# EAGLE design ECG_v2.2 (EAGLE 9.5.2)
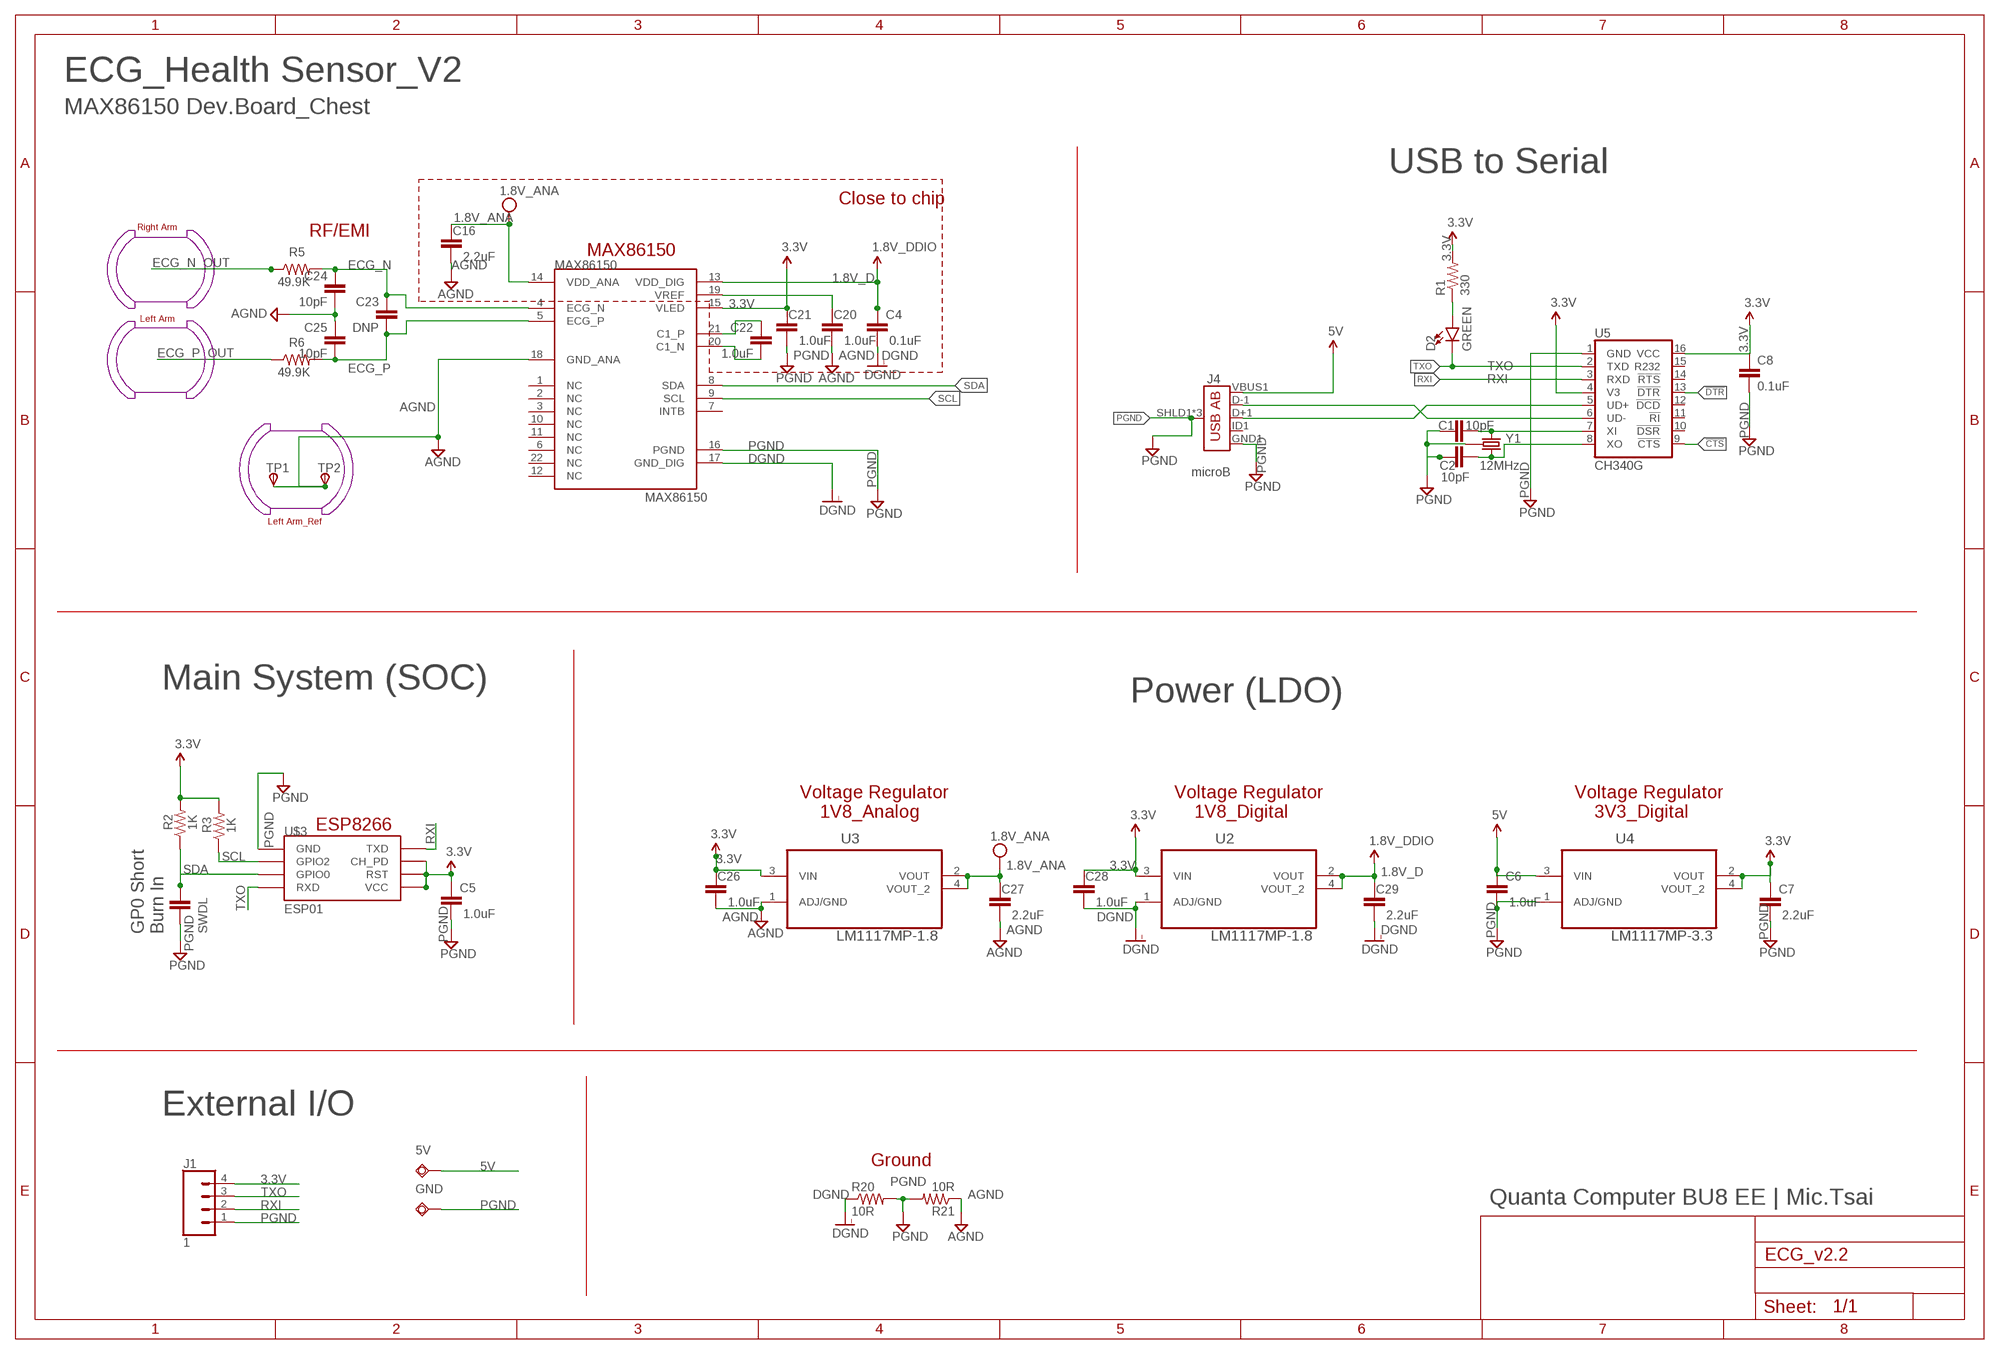
[diagram p0: schematic, sheet 1]

## Parts
5V  TPSQTP20R  [TP20R]
C1  10pF  10PF-50V-5%(0603)  [0603-CAP]
C2  10pF  10PF-50V-5%(0603)  [0603-CAP]
C4  0.1uF  1.0UF-0805-25V-10%  [0805]
C5  1.0uF  1.0UF-0805-25V-10%  [0805]
C6  1.0uF  1.0UF-0805-25V-10%  [0805]
C7  2.2uF  1.0UF-0805-25V-10%  [0805]
C8  0.1uF  0.1UF-25V(+80/-20%)(0603)  [0603-CAP]
C16  2.2uF  1.0UF-0805-25V-10%  [0805]
C20  1.0uF  1.0UF-0805-25V-10%  [0805]
C21  1.0uF  1.0UF-0805-25V-10%  [0805]
C22  1.0uF  1.0UF-0805-25V-10%  [0805]
C23  DNP  1.0UF-0402-16V-10%  [0402]
C24  10pF  1.0UF-0402-16V-10%  [0402]
C25  10pF  1.0UF-0402-16V-10%  [0402]
C26  1.0uF  1.0UF-0805-25V-10%  [0805]
C27  2.2uF  1.0UF-0805-25V-10%  [0805]
C28  1.0uF  1.0UF-0805-25V-10%  [0805]
C29  2.2uF  1.0UF-0805-25V-10%  [0805]
D2  GREEN  LED-GREEN0603  [LED-0603]
GND  TPSQTP20R  [TP20R]
J1  1  CONN_04  [1X04]
J4  microB  USB_AB_SMT  [USB-AB-MICRO-SMD]
MAX86150  MAX86150  [MAX86150]
R1  330  330OHM1/10W1%(0603)  [0603-RES]
R2  1K  RESISTOR0805-RES  [0805]
R3  1K  RESISTOR0805-RES  [0805]
R5  49.9K  RESISTOR0805-RES  [0805]
R6  49.9K  RESISTOR0805-RES  [0805]
R20  10R  RESISTOR0805-RES  [0805]
R21  10R  RESISTOR0805-RES  [0805]
SWDL  10pF  1.0UF-0402-16V-10%  [0402]
TP1  TPSB1,27  [B1,27]
TP2  TPSB1,27  [B1,27]
U2  LM1117MP-1.8  [SOT230P696X180-4N]
U3  LM1117MP-1.8  [SOT230P696X180-4N]
U4  LM1117MP-3.3  [SOT230P696X180-4N]
U5  CH340G  CH340GSMD  [SO016]
U$3  ESP01  [ESP01]
Y1  12MHz  CRYSTAL-GROUNDED3.2X2.5  [CRYSTAL-SMD-3.2X2.5]

## Nets
1.8V_ANA: C16.1 C27.1 MAX86150.14(VDD_ANA) U3.2(VOUT) U3.4(VOUT_2)
1.8V_D: C4.1 C29.1 MAX86150.13(VDD_DIG) U2.2(VOUT) U2.4(VOUT_2) ; supply symbol labelled 1.8V_DDIO
3.3V: C5.1 C7.1 C8.1 C21.1 C26.1 C28.1 J1.4 MAX86150.15(VLED) R1.2 R2.2 R3.2 U2.3(VIN) U3.3(VIN) U4.2(VOUT) U4.4(VOUT_2) U5.4(V3) U5.16(VCC) U$3.CH_PD U$3.RST U$3.VCC
5V: 5V.TP C6.1 J4.VBUS1(VBUS) U4.3(VIN)
!CTS: U5.9(!CTS)
!DTR: U5.13(!DTR)
AGND: C16.2 C20.2 C24.2 C25.1 C26.2 C27.2 MAX86150.18(GND_ANA) R21.1 TP1.PP TP2.PP U3.1(ADJ/GND)
DGND: C4.2 C28.2 C29.2 MAX86150.17(GND_DIG) R20.1 U2.1(ADJ/GND)
ECG_N: C23.1 C24.1 MAX86150.4(ECG_N) R5.2
ECG_N_OUT: R5.1
ECG_P: C23.2 C25.2 MAX86150.5(ECG_P) R6.2
ECG_P_OUT: R6.1
N$2: D2.A R1.1
N$7: C22.1 MAX86150.21(C1_P)
N$8: C22.2 MAX86150.20(C1_N)
N$10: C20.1 MAX86150.19(VREF)
N$12: C2.2 U5.8(XO) Y1.3
N$13: C1.2 U5.7(XI) Y1.1
N$14: J4.D-1(D-) U5.6(UD-)
N$15: J4.D+1(D+) U5.5(UD+)
PGND: C1.1 C2.1 C5.2 C6.2 C7.2 C8.2 C21.2 GND.TP J1.1 J4.GND1(GND) J4.SHLD1(SHIELD) J4.SHLD2(SHIELD) J4.SHLD3(SHIELD) MAX86150.16(PGND) R20.2 R21.2 SWDL.2 U4.1(ADJ/GND) U5.1(GND) U$3.GND Y1.2(GND) Y1.4(GND)
RXI: J1.2 U5.3(RXD) U$3.TX(TXD)
SCL: MAX86150.9(SCL) R3.1 U$3.GPIO2
SDA: MAX86150.8(SDA) R2.1 SWDL.1 U$3.GPIO0
TXO: D2.C J1.3 U5.2(TXD) U$3.RX(RXD)
Unconnected: J4.ID1(USBID) MAX86150.1(NC) MAX86150.2(NC) MAX86150.3(NC) MAX86150.6(NC) MAX86150.7(INTB) MAX86150.10(NC) MAX86150.11(NC) MAX86150.12(NC) MAX86150.22(NC) U5.10(!DSR) U5.11(!RI) U5.12(!DCD) U5.14(!RTS) U5.15(R232)

## Notes on the sheet
- ECG_Health Sensor_V2
- MAX86150 Dev.Board_Chest
- USB to Serial
- Close to chip
- Right Arm
- RF/EMI
- MAX86150
- Left Arm
- Left Arm_Ref
- Main System (SOC)
- Power (LDO)
- Voltage Regulator
      1V8_Analog
- Voltage Regulator
      1V8_Digital
- Voltage Regulator
      3V3_Digital
- ESP8266
- GP0 Short
  Burn In
- External I/O
- Ground
- Quanta Computer BU8 EE | Mic.Tsai

## Library data of the parts
5V GND = testpad:TPSQ: Test pad
C1 C2 = SparkFun-Capacitors:10PF-50V-5%(0603): CAP-11812; PROD_ID: CAP-11812
C4 C7 C16 C27 C29 = SparkFun-Capacitors:1.0UF: 1µF ceramic capacitors A capacitor is a passive two-terminal electrical component used to store electrical energy temporarily in an electric field.; PROD_ID: CAP-08064; VALUE: 1.0uF
C5 C6 C20-C22 C26 C28 = SparkFun-Capacitors:1.0UF: 1µF ceramic capacitors A capacitor is a passive two-terminal electrical component used to store electrical energy temporarily in an electric field.; PROD_ID: CAP-08064
C8 = SparkFun-Capacitors:0.1UF-25V(+80/-20%)(0603): CAP-00810 Ceramic Standard decoupling cap; PROD_ID: CAP-00810
C23-C25 SWDL = SparkFun-Capacitors:1.0UF: 1µF ceramic capacitors A capacitor is a passive two-terminal electrical component used to store electrical energy temporarily in an electric field.; PROD_ID: CAP-12417; VALUE: 1.0uF
D2 = SparkFun-LED:LED-GREEN: Green SMD LED Used in manufacturing of various products at SparkFun Packages: 0603 - SMD 0603 package [Product Link] <http://www.futureelectronics.com/en/technologies/semiconductors/optoelectronics/leds/Pages/9894312-LTST-C190GKT.aspx?CrossPart=HSMG-C190&IM=0> LilyPad 1206 - SMD1206 LilyPad package [Product Link] <http://www.futureelectronics.com/en/Technologies/Product.aspx?ProductID=IN150NGHARVATEKCORPORATION2049943&IM=0> 1206 - SMD1206 package [Product Link] <http://www.futureelectronics.com/en/technologies/semiconductors/optoelectronics/leds/Pages/8315665-LTST-C150KGKT.aspx?IM=0> 1206 Bottom Mount -SMD 1206 Bottom Mount [Product Link] <http://www.digikey.com/product-detail/en/lite-on-inc/LTST-C230KGKT/160-1456-1-ND/386854> SparkFun Products: Pro Mini 328 -5V <https://www.sparkfun.com/products/821> RedBoard <https://www.sparkfun.com/products/12757> MP3 Trigger <https://www.sparkfun.com/products/13720> Makey Makey <https://www.sparkfun.com/products/11076>; PROD_ID: DIO-00821
J1 = SparkFun-Connectors:CONN_04: Multi connection point. Often used as Generic Header-pin footprint for 0.1 inch spaced/style header connections On any of the 0.1 inch spaced packages, you can populate with these: Break Away Headers - Straight <https://www.sparkfun.com/products/116> (PRT-00116) Break Away Male Headers - Right Angle <https://www.sparkfun.com/products/553> (PRT-00553) Female Headers <https://www.sparkfun.com/products/115> (PRT-00115) Break Away Headers - Machine Pin <https://www.sparkfun.com/products/117> (PRT-00117) Break Away Female Headers - Swiss Machine Pin <https://www.sparkfun.com/products/743> (PRT-00743) For SCREWTERMINALS and SPRING TERMINALS visit here: Screw Terimnals on SparkFun.com <https://www.sparkfun.com/search/results?term=Screw+Terminals> (5mm/3.5mm/2.54mm spacing) This device is also useful as a general connection point to wire up your design to another part of your project. Our various solder wires solder well into these plated through hole pads. Hook-Up Wire - Assortment (Stranded, 22 AWG) <https://www.sparkfun.com/products/11375> (PRT-11375) Hook-Up Wire - Assortment (Solid Core, 22 AWG) <https://www.sparkfun.com/products/11367> (PRT-11367) View the entire wire category on our website here <https://www.sparkfun.com/categories/141> Special notes: Molex polarized connector foot print use with SKU : PRT-08231 with associated crimp pins and housings. 1MM SMD Version SKU: PRT-10208; PROD_ID: CONN-09696
J4 = SparkFun-Connectors:USB_AB: USB Type AB Micro Connector OTG-compatible. 5 pins, 3 shield pins SparkFun Products: IOIO-OTG <https://www.sparkfun.com/products/13613> SparkFun SAMD21 Mini Breakout <https://www.sparkfun.com/products/13664>; PROD_ID: CONN-11794
MAX86150 = circuitects:MAX86150
R1 = SparkFun-Resistors:330OHM1/10W1%(0603): RES-00818; PROD_ID: RES-00818
R2 R3 R5 R6 R20 R21 = SparkFun:RESISTOR: Resistor Basic schematic elements and footprints for 0603, 1206, and PTH resistors.
TP1 TP2 = testpad:TPS: TEST PIN
U2 U3 = LM1117MP-1.8:LM1117MP-1.8: IC REG LDO 800MA 1.8V; AVAILABILITY: Unavailable; DESCRIPTION: Linear Voltage Regulator IC 1 Output 800mA SOT-223; MF: Texas Instruments; MP: LM1117MP-1.8/NOPB; PACKAGE: SOT-223 Texas Instruments; PRICE: None
U4 = LM1117MP-3.3:LM1117MP-3.3: IC REG LDO 800MA 3.3V; AVAILABILITY: Unavailable; DESCRIPTION: Linear Voltage Regulator IC 1 Output 800mA SOT-223; MF: Texas Instruments; MP: LM1117MP-1.8/NOPB; PACKAGE: SOT-223 Texas Instruments; PRICE: None
U5 = SparkFun-DigitalIC:CH340G: A simple USB 2.0 to Serial IC.; PROD_ID: IC-13498
U$3 = esp8266modules:ESP01: ESP8266 Wifi module 01
Y1 = USB Basic:CRYSTAL-GROUNDED: Small, 3.2x2.5mm, SMD Crystal; PROD_ID: XTAL-13518

## Net classes
1 power: width 0.178 mm
2 gnd: width 0.254 mm, drill 0.254 mm, clearance 0.178 mm

## Board
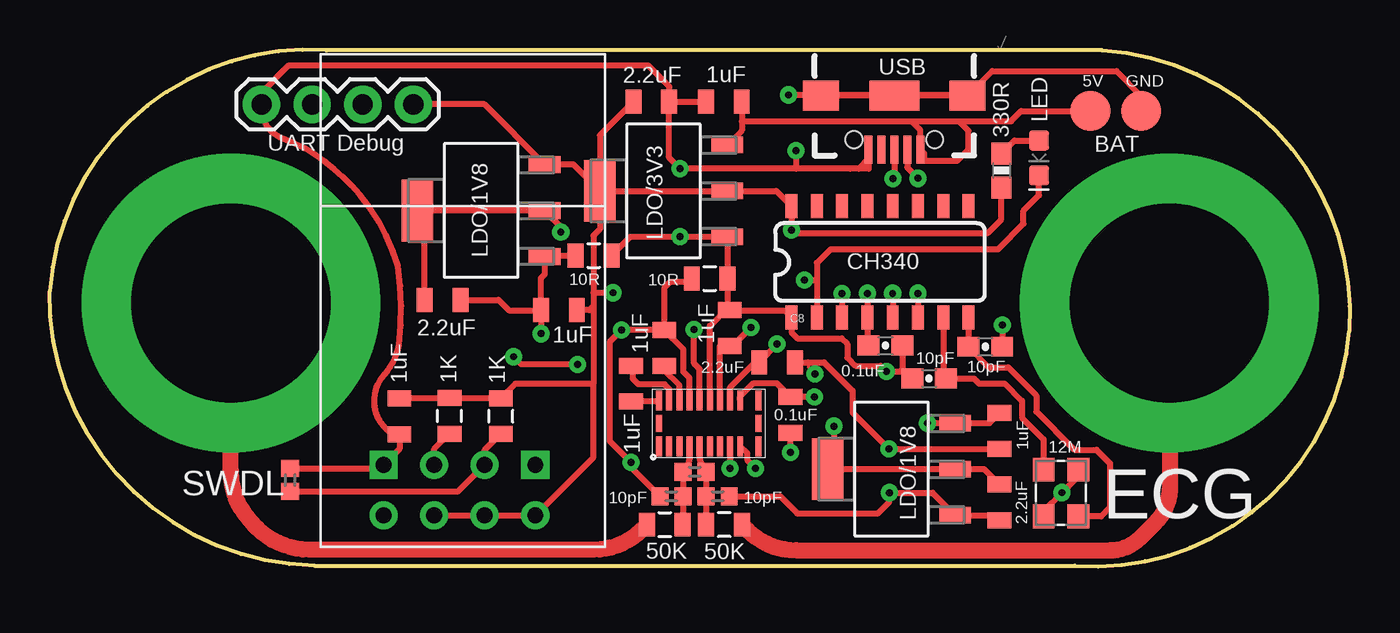
[diagram p1: board, top side]
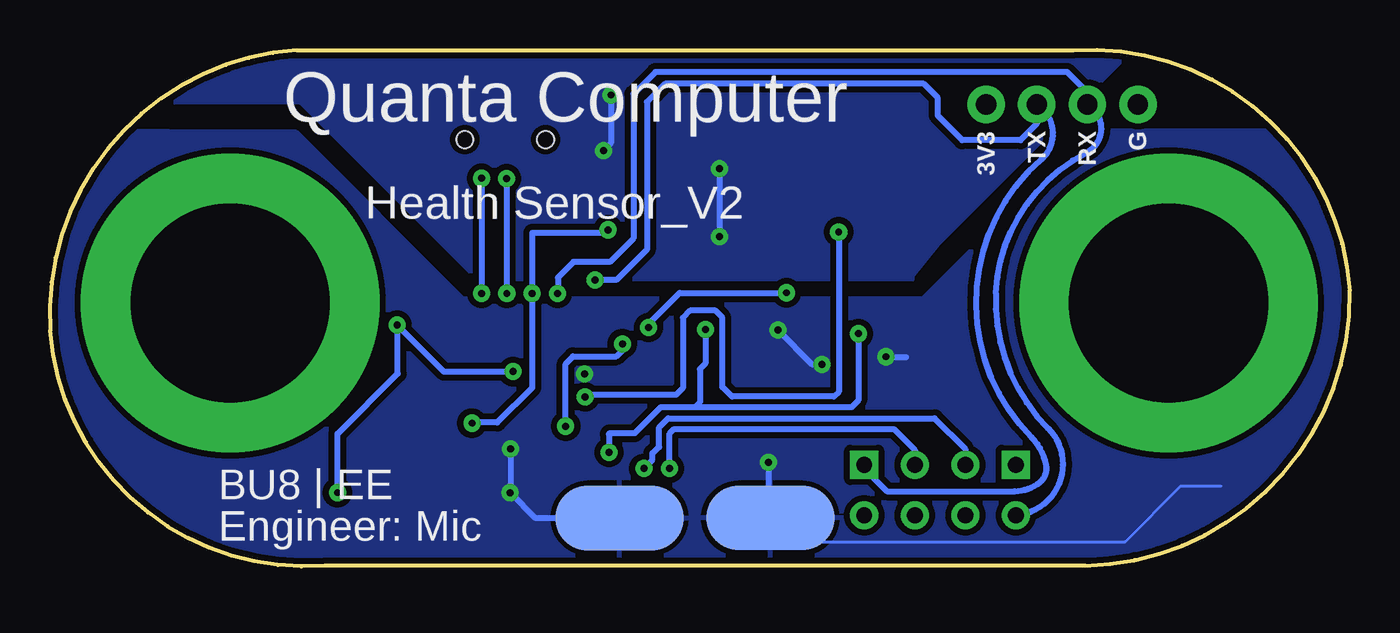
[diagram p2: board, bottom side, seen from below]

Size 65.31 x 25.97 mm. Coordinates in mm from the lower left corner, seen from the top.
Outline: 52.88,25.94 13.9,25.94 arc90 0,13.84 arc90 13.3,0.04 51.49,0.04 arc90 65.29,11.84 arc90 52.88,25.94
Copper layers (1*16): Top 0.035mm / dielectric 1.5mm / Bottom 0.035mm
Design rules "Circuitects-Rules *": minimum track width 6mil, minimum drill 0.3mm, track to track 6mil, track to pad 6mil, pad to pad 6mil, via to via 6mil, smd to smd 6mil, copper to edge 10mil, drill to drill 8mil, minimum pad ring 12mil, minimum via ring 10mil, stop-mask expansion 4mil, vias tented up to drill 25mil, thermal gap 10mil

### Footprints (pad centres in the part's own frame; a part is rotated, then mirrored left to right if it is on the bottom)
TP20R = smd 2 x 2: TP 0,0
0603-CAP = smd 1.1 x 1: 1 -0.85,0; 2 0.85,0
0805 = smd 0.8 x 1.2: 1 -0.9,0; 2 0.9,0
0402 = smd 0.85 x 0.9: 1 -0.58,0; 2 0.58,0
LED-0603 = smd 1 x 1: A -0.877,0; C 0.877,0
1X04 = drill 1.016 pad 1.88: 1 0,0; 2 2.54,0; 3 5.08,0; 4 7.62,0
USB-AB-MICRO-SMD = smd 1.4 x 0.4: D+1 2.7,0; D-1 2.7,0.65; GND1 2.7,-1.3; ID1 2.7,-0.65; VBUS1 2.7,1.3 | smd 1.5 x 1.8: SHLD1 0,-3.68; SHLD2 0,3.68 | smd 1.5 x 2.5: SHLD3 0,0 | hole 0.85: 2.2,2.027; 2.2,-2.027
MAX86150 = smd 1 x 0.3: 1 -1.15,2.5; 2 -1.15,1.99; 3 -1.15,1.48; 4 -1.15,0.97; 5 -1.15,0.46; 6 -1.15,-0.05; 7 -1.15,-0.56; 8 -1.15,-1.07; 9 -1.15,-1.58; 10 -1.15,-2.5; 12 1.15,-2.5; 13 1.15,-1.58; 14 1.15,-1.07; 15 1.15,-0.56; 16 1.15,-0.05; 17 1.15,0.46; 18 1.15,0.97; 19 1.15,1.48; 20 1.15,1.99; 21 1.15,2.5 | smd 0.85 x 0.3: 11 0,-2.5; 22 0,2.5
0603-RES = smd 1.1 x 1: 1 -0.85,0; 2 0.85,0
B1,27 = smd 6.452 x 3.251: PP 0,0
SOT230P696X180-4N = smd 1.6 x 0.838: 1 -3.2,2.311; 2 -3.2,0; 3 -3.2,-2.311 | smd 1.6 x 3.099: 4 3.2,0
SO016 = smd 0.6 x 1.2: 1 -4.445,-2.8; 2 -3.175,-2.8; 3 -1.905,-2.8; 4 -0.635,-2.8; 5 0.635,-2.8; 6 1.905,-2.8; 7 3.175,-2.8; 8 4.445,-2.8; 9 4.445,2.8; 10 3.175,2.8; 11 1.905,2.8; 12 0.635,2.8; 13 -0.635,2.8; 14 -1.905,2.8; 15 -3.175,2.8; 16 -4.445,2.8
ESP01 = drill 0.8: CH_PD -1.285,-8.178; GPIO0 1.255,-5.638; GPIO2 -1.285,-5.638; RST 1.255,-8.178; TX -3.825,-8.178; VCC 3.795,-8.178 | drill 0.8 square: GND -3.825,-5.638; RX 3.795,-5.638
CRYSTAL-SMD-3.2X2.5 = smd 1.2 x 1.1: 1 -1.175,-0.875; 2 1.175,-0.875; 3 1.175,0.875; 4 -1.175,0.875

### Placement (x,y rotation side)
5V  52.28,22.88 0 top
C1  44.18,9.44 0 top
C2  47,11.04 180 top
C4  37.21,7.61 270 top
C5  17.57,7.54 270 top
C6  33.87,23.36 180 top
C7  30.22,23.35 0 top
C8  41.98,11.09 0 top
C16  36.55,10.25 0 top
C20  30.87,10.98 90 top
C21  34.16,11.97 90 top
C22  29.2,9.18 90 top
C23  32.4,4.75 0 top
C24  31.23,3.52 180 top
C25  33.56,3.52 180 top
C26  47.72,6.8 270 top
C27  47.72,3.21 270 top
C28  25.58,12.88 180 top
C29  19.74,13.39 0 top
D2  49.7,20.53 270 top
GND  54.82,22.88 0 top
J1  10.64,23.22 0 top
J4  42.43,23.65 270 top
MAX86150  33.11,7.19 90 top
R1  47.81,19.89 270 top
R2  22.66,7.55 90 top
R3  20.08,7.56 90 top
R5  30.9,2.1 0 top
R6  33.88,2.1 180 top
R20  27.33,15.62 0 top
R21  33.16,14.47 0 top
SWDL  12.08,4.34 90 top
TP1  36.69,2.42 0 bottom
TP2  29.11,2.43 0 bottom
U2  21.67,17.88 180 top
U3  42.29,4.89 180 top
U4  30.84,18.87 180 top
U5  41.71,15.3 0 top
U$3  20.6,10.74 0 top
Y1  50.81,3.69 270 top

### Tracks (layer width: path | path; a pad name or v marks a point on that pad's centre or on a via)
1.8V_ANA  (via drill 0.35)
  Top 0.305: MAX86150.14 34.18,9 35.44,10.25 C16.1 35.65,10.28 v36.55,11.18 | C27.1 46.94,4.89 U3.2 U3.4 39.39,5.19 v39.39,7.04
  Bottom 0.305: v39.39,7.04 39.39,10.18 39.02,10.55 36.84,10.55 36.55,10.84 v36.55,11.18
1.8V_D  (via drill 0.35)
  Top 0.305: MAX86150.13 34.69,8.54 35.36,9.22 36.51,9.22 C4.1 v38.41,8.51 v38.41,8.52 | C29.1 18.84,17.51 U2.4 U2.2 25.68,17.08 v25.68,16.81
  Bottom 0.305: v25.68,16.81 25.68,8.77 25.92,8.53 31.03,8.53 31.52,9.01 31.52,12.5 31.86,12.85 33.14,12.85 33.5,12.49 33.5,8.96 33.84,8.62 38.31,8.62 v38.41,8.52
3.3V  (via drill 0.35)
  Top 0.305: MAX86150.15 33.67,11.07 C21.1 34.29,11.07 v35.22,12.01 | U$3.CH_PD U$3.RST U$3.VCC 27.31,5.48 27.31,9.18 | U4.4 26.31,20.19 U2.3 21.84,23.22 J1.4 | U4.4 U4.2 36.5,18.87 U5.16 v37.27,16.91 37.42,16.76 47.14,16.76 47.81,17.43 R1.2 | C7.1 27.64,21.66 U4.4 | C5.1 20.06,8.44 R3.2 20.1,8.45 R2.2 23.39,9.18 27.31,9.18 | U4.4 27.64,16.94 27.31,16.62 27.31,13.75 | C28.1 27.12,12.88 27.31,13.08 | 27.31,13.75 27.31,13.08 | 27.31,13.08 27.31,9.18 | v41.08,13.72 U5.4 41.08,11.14 C8.1 | C26.1 47.21,7.2 U3.3 v44.1,7.2 | v28.3,13.75 27.31,13.75
  Bottom 0.305: v37.27,16.91 37.42,16.76 41.08,16.76 v41.08,13.72 41.08,8.97 42.83,7.22 44.08,7.22 v44.1,7.2 | v35.22,12.01 35.22,12.19 33.66,13.75 v28.3,13.75
5V
  Top 0.305: C6.1 34.77,22.37 | 34.77,22.37 34.77,21.91 U4.3 | 34.77,22.37 43.29,22.37 | 43.29,22.37 43.73,21.93 J4.VBUS1 43.92,20.76 43.92,20.39 45.6,20.39 46.16,20.95 46.16,21.89 45.68,22.37 | 43.29,22.37 45.68,22.37 | 45.68,22.37 48.29,22.37 48.8,22.88 5V.TP
AGND  (via drill 0.35)
  Top 0.152: 38.11,10.25 38.11,10 v38.44,9.67
  Top 0.305: MAX86150.18 32.14,9.47 31.83,9.77 31.83,10.92 C20.2 | C27.2 47.45,2.57 U3.1 44.36,3.7 v42.18,3.7 42.18,3.25 41.6,2.66 37.56,2.66 36.7,3.52 C25.1 | R21.1 32.07,14.28 31.17,14.28 30.87,13.98 C20.2 | C16.2 38.11,10.25 38.9,10.25 40.33,8.82 40.33,7.73 v42.16,5.9 C26.2 | C20.2 v28.73,11.88 28.13,11.27 28.13,6.3 v29.2,5.23 29.2,4.98 C24.2 | v26.53,10.15 23.68,10.15 v23.3,10.54
  Bottom 0.152: TP2.PP 27.92,1.24 11.29,1.24 8.49,4.03 6.46,4.03
  Bottom 0.305: v42.16,5.9 42.16,3.7 42.17,3.69 | 42.17,3.69 v42.18,3.7 | TP1.PP 40.9,2.42 42.17,3.69 | TP2.PP 29.27,2.42 29.2,2.5 v29.2,5.23 | v28.73,11.88 27.01,10.15 v26.53,10.15 | v23.3,10.54 23.28,10.51 22.28,10.51
  pour Bottom (isolate 0.305, rank 6): 65.66,-0.55 -0.44,-0.55 -0.44,21.87 13,21.87 21.45,13.43 44.56,13.43 52.94,21.81 65.66,21.87
DGND  (via drill 0.35)
  Top 0.305: MAX86150.17 32.65,9.91 32.37,10.19 v32.37,11.91 | v37.22,5.72 v37.21,5.73 C4.2 | R20.1 24.92,15.62 U2.1 24.87,14.67 24.67,14.47 24.67,12.87 | 24.67,12.87 C28.2 | C29.2 22.55,13.39 23.07,12.87 24.67,12.87 | C28.2 | C28.2 v24.68,11.69 C28.2 | C28.2
  Bottom 0.305: v32.37,11.91 32.37,10.19 32.65,9.91 32.65,8.25 32.9,8 | v37.22,5.72 37.22,6.65 37.18,6.69 35.92,6.69 34.62,8 32.9,8 | 32.9,8 25.03,8 24.68,8.34 v24.68,11.69
ECG_N
  Top 0.305: MAX86150.4 32.14,5.52 arc-45 C23.1 C24.1 R5.2
ECG_N_OUT  (via drill 10 pad 15)
  Top 0.813: R5.1 29.72,1.82 arc-45 27.34,0.83 13.05,0.83 arc-45 10.43,1.92 10.2,2.14 arc-45 9.1,4.81 v9.1,13.24
ECG_P
  Top 0.305: MAX86150.5 32.65,5.55 arc45 C23.2 C25.2 R6.2
ECG_P_OUT  (via drill 10 pad 15)
  Top 0.813: R6.1 35.05,1.82 arc45 37.5,0.81 53.3,0.81 arc45 54.77,1.42 55.55,2.2 arc45 56.29,3.99 56.29,13.13 arc45 v56.25,13.24
N$2
  Top 0.305: R1.1 48.47,21.4 D2.A
N$7
  Top 0.305: MAX86150.21 arc-45 30.46,8.28 C22.1
N$8
  Top 0.305: MAX86150.20 31.12,8.91 30.89,9.14 29.57,9.14 29.29,9.42 29.29,9.98 C22.2
N$10
  Top 0.305: MAX86150.19 31.63,9.11 30.87,9.87 C20.1
N$12
  Top 0.305: U5.8 C2.2 47.19,10 48.16,10 49.56,8.6 49.56,7.78 51.48,5.86 52.59,5.86 53.27,5.18 53.27,2.95 52.83,2.51 Y1.3
N$13
  Top 0.305: U5.7 44.89,9.59 C1.2 46.44,9.44 46.69,9.19 47.98,9.19 48.85,8.31 48.85,7.46 49.93,6.38 Y1.1
N$14  (via drill 0.35)
  Top 0.305: J4.D-1 43.08,20.04 v43.62,19.5 | v43.62,13.72 U5.6
  Bottom 0.305: v43.62,19.5 v43.62,13.72
N$15  (via drill 0.35)
  Top 0.305: J4.D+1 42.43,19.56 v42.36,19.49 | v42.35,13.72 U5.5
  Bottom 0.305: v42.36,19.49 42.36,13.74 v42.35,13.72
PGND  (via drill 0.35)
  Top 0.305: SWDL.2 16.59,4.92 U$3.GND 17.57,5.89 C5.2 17.54,6.64 arc-45 16.89,6.91 arc-87 16.82,9.64 arc32 17.54,11.13 arc16 17.5,15.08 arc8 17.5,15.09 arc24 15.57,18.69 arc13 13.81,20.35 arc17 11.7,21.51 arc-76 J1.1 10.64,23.81 12.01,25.18 30.07,25.18 31.12,24.13 C7.2 | C7.2 32.96,23.35 C6.2 | 34.05,12.98 R21.2 34.04,14.48 U4.1 v31.67,16.57 29.18,16.57 R20.2 | 34.05,12.98 C21.2 34.19,12.85 36.93,12.85 U5.1 37.27,11.76 37.56,11.46 39.78,11.46 40.08,11.17 40.08,10.49 40.48,10.08 41.74,10.08 v42.03,9.79 42.99,9.79 C1.1 42.83,9.94 C8.2 | 37.51,19.98 40.64,19.98 41.13,20.48 J4.GND1 41.13,19.99 40.21,19.99 | 37.51,19.98 v31.67,19.98 31.12,20.53 C7.2 | Y1.4 51.68,4.53 v50.86,3.7 49.93,2.78 Y1.2 | v47.86,12.12 47.86,11.05 C2.1 | 34.05,12.98 33.16,12.09 33.16,11.69 MAX86150.16 | J4.SHLD2 J4.SHLD3 J4.SHLD1 | J4.SHLD2 46.07,23.69 v37.12,23.69 | v37.5,20.9 37.5,20 37.51,19.98 | GND.TP 54.82,23.67 53.6,24.89 47.35,24.89 J4.SHLD2
  Bottom 0.305: v31.67,19.98 v31.67,16.57 | v50.86,3.7 50.86,6.66 47.84,9.69 47.84,12.1 v47.86,12.12 45.52,9.79 v42.03,9.79 | v37.5,20.9 37.12,21.28 v37.12,23.69
  pour Bottom (isolate 0.305, rank 6): 21.95,14.45 43.8,14.45 52.69,23.34 64.83,23.34 67.93,26.43 35.83,26.43 10.46,26.45 20.68,16.23 22.04,14.53
RXI  (via drill 0.35)
  Top 0.305: v39.8,13.71 39.8,12.51 U5.3
  Bottom 0.305: U$3.TX arc-130 15.17,6.95 arc48 17.78,13.74 arc60 13.23,20.79 arc-123 J1.2 13.18,23.84 14.19,24.85 34.88,24.85 35.99,23.74 35.99,16.48 37.17,15.3 39,15.3 39.78,14.51 39.78,13.72 v39.8,13.71
SCL  (via drill 0.35)
  Top 0.305: MAX86150.9 35.03,5.69 35.03,5.35 v35.47,4.92 | U$3.GPIO2 19.32,5.89 R3.1
  Bottom 0.305: v35.47,4.92 35.03,5.35 35.03,5.68 34.73,5.99 34.69,5.99 34.69,6.99 34.25,7.44 20.86,7.44 19.32,5.89 U$3.GPIO2
SDA  (via drill 0.35)
  Top 0.305: MAX86150.8 34.18,5.31 34.17,5.3 v34.17,4.92 | R2.1 21.86,5.84 U$3.GPIO0 20.51,3.76 SWDL.1
  Bottom 0.305: v34.17,4.92 34.17,6.68 33.94,6.9 22.91,6.9 21.85,5.85 U$3.GPIO0
TXO  (via drill 0.35)
  Top 0.305: 38.54,14.42 38.54,15.25 39.24,15.95 47.66,15.95 48.93,17.22 48.93,17.88 49.7,18.65 D2.C | 38.54,14.42 U5.2 | v37.92,14.4 38.51,14.4 38.54,14.42
  Bottom 0.305: U$3.RX 24.39,4.91 23.26,3.78 16.84,3.78 arc-39 15.57,4.22 arc-61 15.25,5.06 arc-35 15.98,6.48 arc94 15.5,20.44 arc-107 J1.3 15.72,22.24 16.54,21.42 19.46,21.42 20.7,22.65 20.7,23.55 21.39,24.25 34.4,24.25 35.31,23.34 35.31,15.92 36.84,14.4 v37.92,14.4

### Text on the board
tPlace: USB | 2.2uF | 1uF | UART Debug | 330R | LED | BAT | LDO/1V8 | LDO/3V3 | CH340 | 10R | 10R | 2.2uF | 1uF | 1uF | 1uF | 2.2uF | 0.1uF | 10pF | 10pF | 1uF | 1K | 1K | 0.1uF | 1uF | 1uF | 12M | 10pF | 10pF | LDO/1V8 | 2.2uF | ECG | 50K | 50K
bPlace: G | RX | TX | 3V3 | Quanta Computer | Health Sensor_V2 | BU8 | EE | Engineer: Mic
Measures: All dimensions in inches | All dimensions in inches